# EAGLE schematic pcb (EAGLE 9.3.2)
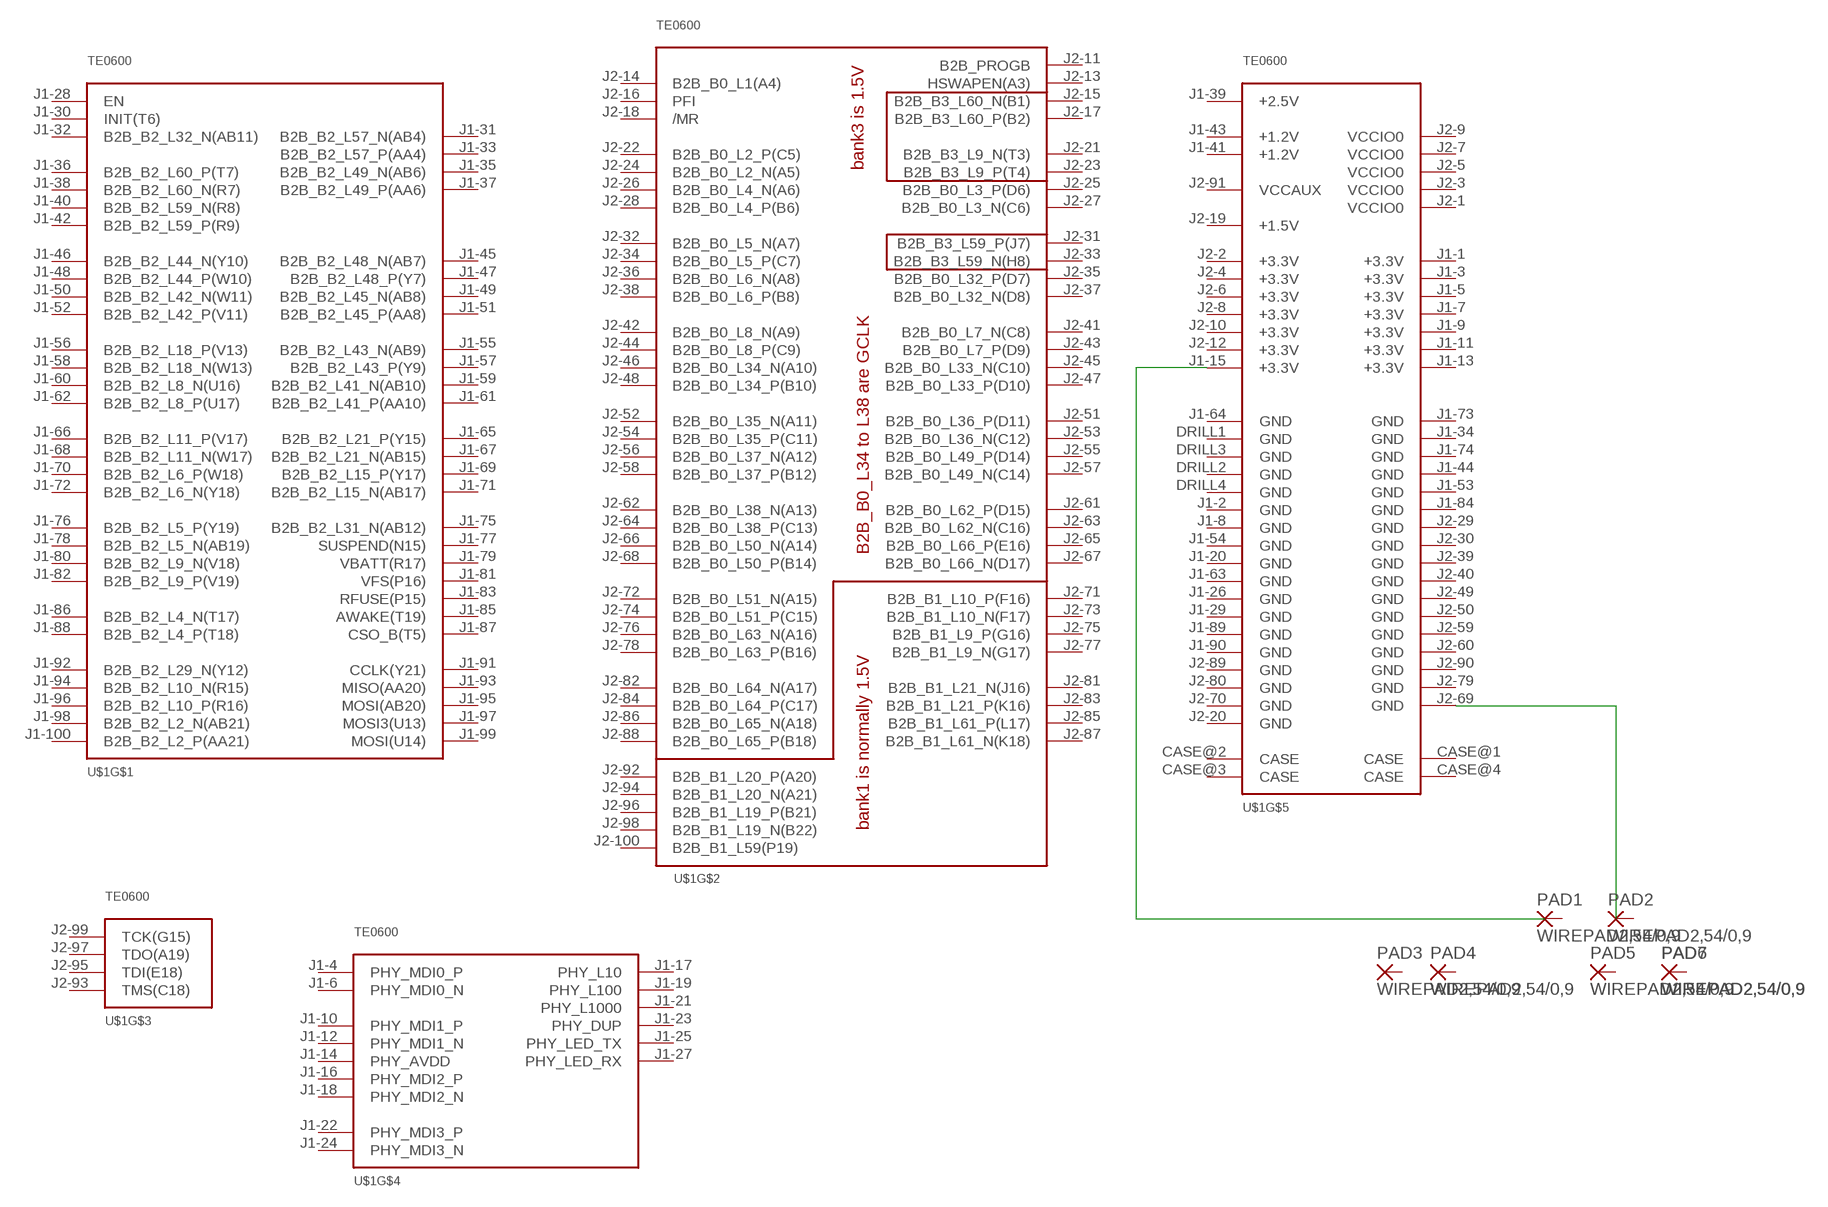
[diagram p0: schematic, sheet 1]

## Parts
PAD1  WIREPAD2,54/0,9  [2,54/0,9]
PAD2  WIREPAD2,54/0,9  [2,54/0,9]
PAD3  WIREPAD2,54/0,9  [2,54/0,9]
PAD4  WIREPAD2,54/0,9  [2,54/0,9]
PAD5  WIREPAD2,54/0,9  [2,54/0,9]
PAD6  WIREPAD2,54/0,9  [2,54/0,9]
PAD7  WIREPAD2,54/0,9  [2,54/0,9]
U$1  TE0600  [TE0600]

## Nets
GND@30: U$1.J2-69(GND)
N$1: U$1.J1-15(+3.3V)
N$2: PAD6.1(P) PAD7.1(P)
Unconnected: PAD1.1(P) PAD2.1(P) PAD3.1(P) PAD4.1(P) PAD5.1(P) U$1.CASE@1(CASE) U$1.CASE@2(CASE) U$1.CASE@3(CASE) U$1.CASE@4(CASE) U$1.DRILL1(GND) U$1.DRILL2(GND) U$1.DRILL3(GND) U$1.DRILL4(GND) U$1.J1-2(GND) U$1.J1-4(PHY_MDI0_P) U$1.J1-6(PHY_MDI0_N) U$1.J1-8(GND) U$1.J1-10(PHY_MDI1_P) U$1.J1-12(PHY_MDI1_N) U$1.J1-14(PHY_AVDD) U$1.J1-16(PHY_MDI2_P) U$1.J1-17(PHY_L10) U$1.J1-18(PHY_MDI2_N) U$1.J1-19(PHY_L100) U$1.J1-20(GND) U$1.J1-21(PHY_L1000) U$1.J1-22(PHY_MDI3_P) U$1.J1-23(PHY_DUP) U$1.J1-24(PHY_MDI3_N) U$1.J1-25(PHY_LED_TX) U$1.J1-26(GND) U$1.J1-27(PHY_LED_RX) U$1.J1-28(EN) U$1.J1-29(GND) U$1.J1-30(INIT(T6)) U$1.J1-31(B2B_B2_L57_N(AB4)) U$1.J1-32(B2B_B2_L32_N(AB11)) U$1.J1-33(B2B_B2_L57_P(AA4)) U$1.J1-34(GND) U$1.J1-35(B2B_B2_L49_N(AB6)) U$1.J1-36(B2B_B2_L60_P(T7)) U$1.J1-37(B2B_B2_L49_P(AA6)) U$1.J1-38(B2B_B2_L60_N(R7)) U$1.J1-39(+2.5V) U$1.J1-40(B2B_B2_L59_N(R8)) U$1.J1-41(+1.2V) U$1.J1-42(B2B_B2_L59_P(R9)) U$1.J1-43(+1.2V) U$1.J1-44(GND) U$1.J1-45(B2B_B2_L48_N(AB7)) U$1.J1-46(B2B_B2_L44_N(Y10)) U$1.J1-47(B2B_B2_L48_P(Y7)) U$1.J1-48(B2B_B2_L44_P(W10)) U$1.J1-49(B2B_B2_L45_N(AB8)) U$1.J1-50(B2B_B2_L42_N(W11)) U$1.J1-51(B2B_B2_L45_P(AA8)) U$1.J1-52(B2B_B2_L42_P(V11)) U$1.J1-53(GND) U$1.J1-54(GND) U$1.J1-55(B2B_B2_L43_N(AB9)) U$1.J1-56(B2B_B2_L18_P(V13)) U$1.J1-57(B2B_B2_L43_P(Y9)) U$1.J1-58(B2B_B2_L18_N(W13)) U$1.J1-59(B2B_B2_L41_N(AB10)) U$1.J1-60(B2B_B2_L8_N(U16)) U$1.J1-61(B2B_B2_L41_P(AA10)) U$1.J1-62(B2B_B2_L8_P(U17)) U$1.J1-63(GND) U$1.J1-64(GND) U$1.J1-65(B2B_B2_L21_P(Y15)) U$1.J1-66(B2B_B2_L11_P(V17)) U$1.J1-67(B2B_B2_L21_N(AB15)) U$1.J1-68(B2B_B2_L11_N(W17)) U$1.J1-69(B2B_B2_L15_P(Y17)) U$1.J1-70(B2B_B2_L6_P(W18)) U$1.J1-71(B2B_B2_L15_N(AB17)) U$1.J1-72(B2B_B2_L6_N(Y18)) U$1.J1-73(GND) U$1.J1-74(GND) U$1.J1-75(B2B_B2_L31_N(AB12)) U$1.J1-76(B2B_B2_L5_P(Y19)) U$1.J1-77(SUSPEND(N15)) U$1.J1-78(B2B_B2_L5_N(AB19)) U$1.J1-79(VBATT(R17)) U$1.J1-80(B2B_B2_L9_N(V18)) U$1.J1-81(VFS(P16)) U$1.J1-82(B2B_B2_L9_P(V19)) U$1.J1-83(RFUSE(P15)) U$1.J1-84(GND) U$1.J1-85(AWAKE(T19)) U$1.J1-86(B2B_B2_L4_N(T17)) U$1.J1-87(CSO_B(T5)) U$1.J1-88(B2B_B2_L4_P(T18)) U$1.J1-89(GND) U$1.J1-90(GND) U$1.J1-91(CCLK(Y21)) U$1.J1-92(B2B_B2_L29_N(Y12)) U$1.J1-93(MISO(AA20)) U$1.J1-94(B2B_B2_L10_N(R15)) U$1.J1-95(MOSI(AB20)) U$1.J1-96(B2B_B2_L10_P(R16)) U$1.J1-97(MOSI3(U13)) U$1.J1-98(B2B_B2_L2_N(AB21)) U$1.J1-99(MOSI(U14)) U$1.J1-100(B2B_B2_L2_P(AA21)) U$1.J2-1(VCCIO0) U$1.J2-3(VCCIO0) U$1.J2-5(VCCIO0) U$1.J2-7(VCCIO0) U$1.J2-9(VCCIO0) U$1.J2-11(B2B_PROGB) U$1.J2-13(HSWAPEN(A3)) U$1.J2-14(B2B_B0_L1(A4)) U$1.J2-15(B2B_B3_L60_N(B1)) U$1.J2-16(PFI) U$1.J2-17(B2B_B3_L60_P(B2)) U$1.J2-18(/MR) U$1.J2-19(+1.5V) U$1.J2-20(GND) U$1.J2-21(B2B_B3_L9_N(T3)) U$1.J2-22(B2B_B0_L2_P(C5)) U$1.J2-23(B2B_B3_L9_P(T4)) U$1.J2-24(B2B_B0_L2_N(A5)) U$1.J2-25(B2B_B0_L3_P(D6)) U$1.J2-26(B2B_B0_L4_N(A6)) U$1.J2-27(B2B_B0_L3_N(C6)) U$1.J2-28(B2B_B0_L4_P(B6)) U$1.J2-29(GND) U$1.J2-30(GND) U$1.J2-31(B2B_B3_L59_P(J7)) U$1.J2-32(B2B_B0_L5_N(A7)) U$1.J2-33(B2B_B3_L59_N(H8)) U$1.J2-34(B2B_B0_L5_P(C7)) U$1.J2-35(B2B_B0_L32_P(D7)) U$1.J2-36(B2B_B0_L6_N(A8)) U$1.J2-37(B2B_B0_L32_N(D8)) U$1.J2-38(B2B_B0_L6_P(B8)) U$1.J2-39(GND) U$1.J2-40(GND) U$1.J2-41(B2B_B0_L7_N(C8)) U$1.J2-42(B2B_B0_L8_N(A9)) U$1.J2-43(B2B_B0_L7_P(D9)) U$1.J2-44(B2B_B0_L8_P(C9)) U$1.J2-45(B2B_B0_L33_N(C10)) U$1.J2-46(B2B_B0_L34_N(A10)) U$1.J2-47(B2B_B0_L33_P(D10)) U$1.J2-48(B2B_B0_L34_P(B10)) U$1.J2-49(GND) U$1.J2-50(GND) U$1.J2-51(B2B_B0_L36_P(D11)) U$1.J2-52(B2B_B0_L35_N(A11)) U$1.J2-53(B2B_B0_L36_N(C12)) U$1.J2-54(B2B_B0_L35_P(C11)) U$1.J2-55(B2B_B0_L49_P(D14)) U$1.J2-56(B2B_B0_L37_N(A12)) U$1.J2-57(B2B_B0_L49_N(C14)) U$1.J2-58(B2B_B0_L37_P(B12)) U$1.J2-59(GND) U$1.J2-60(GND) U$1.J2-61(B2B_B0_L62_P(D15)) U$1.J2-62(B2B_B0_L38_N(A13)) U$1.J2-63(B2B_B0_L62_N(C16)) U$1.J2-64(B2B_B0_L38_P(C13)) U$1.J2-65(B2B_B0_L66_P(E16)) U$1.J2-66(B2B_B0_L50_N(A14)) U$1.J2-67(B2B_B0_L66_N(D17)) U$1.J2-68(B2B_B0_L50_P(B14)) U$1.J2-70(GND) U$1.J2-71(B2B_B1_L10_P(F16)) U$1.J2-72(B2B_B0_L51_N(A15)) U$1.J2-73(B2B_B1_L10_N(F17)) U$1.J2-74(B2B_B0_L51_P(C15)) U$1.J2-75(B2B_B1_L9_P(G16)) U$1.J2-76(B2B_B0_L63_N(A16)) U$1.J2-77(B2B_B1_L9_N(G17)) U$1.J2-78(B2B_B0_L63_P(B16)) U$1.J2-79(GND) U$1.J2-80(GND) U$1.J2-81(B2B_B1_L21_N(J16)) U$1.J2-82(B2B_B0_L64_N(A17)) U$1.J2-83(B2B_B1_L21_P(K16)) U$1.J2-84(B2B_B0_L64_P(C17)) U$1.J2-85(B2B_B1_L61_P(L17)) U$1.J2-86(B2B_B0_L65_N(A18)) U$1.J2-87(B2B_B1_L61_N(K18)) U$1.J2-88(B2B_B0_L65_P(B18)) U$1.J2-89(GND) U$1.J2-90(GND) U$1.J2-91(VCCAUX) U$1.J2-92(B2B_B1_L20_P(A20)) U$1.J2-93(TMS(C18)) U$1.J2-94(B2B_B1_L20_N(A21)) U$1.J2-95(TDI(E18)) U$1.J2-96(B2B_B1_L19_P(B21)) U$1.J2-97(TDO(A19)) U$1.J2-98(B2B_B1_L19_N(B22)) U$1.J2-99(TCK(G15)) U$1.J2-100(B2B_B1_L59(P19))

## Power pins joined to a net without a drawn wire
+3.3V: U$1.J1-1(+3.3V) U$1.J1-3(+3.3V) U$1.J1-5(+3.3V) U$1.J1-7(+3.3V) U$1.J1-9(+3.3V) U$1.J1-11(+3.3V) U$1.J1-13(+3.3V) U$1.J2-2(+3.3V) U$1.J2-4(+3.3V) U$1.J2-6(+3.3V) U$1.J2-8(+3.3V) U$1.J2-10(+3.3V) U$1.J2-12(+3.3V)

## Library data of the parts
PAD1-PAD7 = wirepad:WIREPAD: Wire PAD connect wire on PCB
U$1 = lib-te0600-eagle:TE0600: TE0600 datasheets LSHM Connector <http://www.samtec.com/ProductInformation/TechnicalSpecifications/Prints.aspx?series=LSHM> TE0600 Trenz archive <http://www.trenz-electronic.de/de/download/d0/Trenz_Electronic/d1/TE0600-GigaBee_series/d2/TE0600/d3/documents.html> update 12.04.2013: - FPGA pins added to symbols designed by: steffen.mauch (at) gmail.com copyright (c) 2012/2013